# EAGLE design DWM_shield (EAGLE 7.5.0)
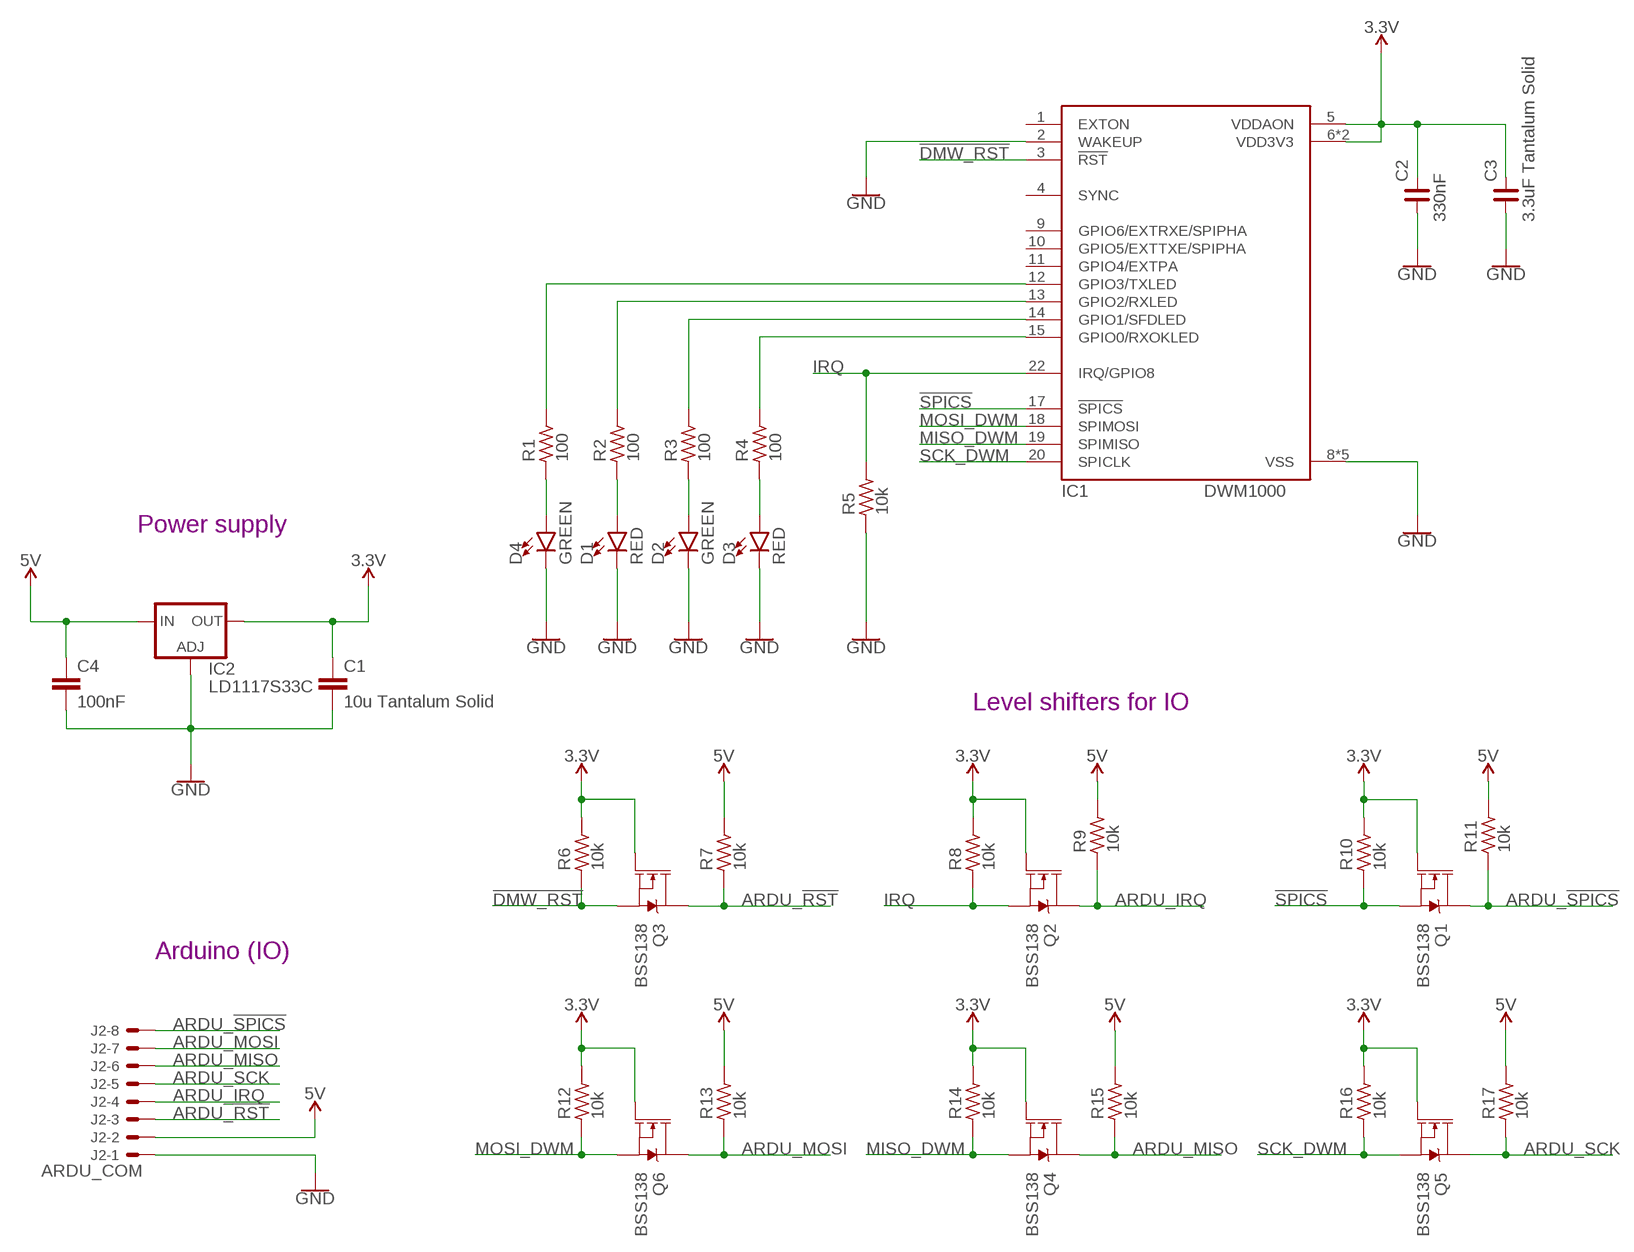
[diagram p0: schematic, sheet 1]

## Parts
C1  10u Tantalum Solid  C-EUC1206  [C1206]
C2  330nF  C_0805  [C0805]
C3  3.3uF Tantalum Solid  C_1206  [C1206]
C4  100nF  C-EUC0805  [C0805]
D1  RED  LED-RED1206  [LED-1206]
D2  GREEN  LED-GREEN1206  [LED-1206]
D3  RED  LED-RED1206  [LED-1206]
D4  GREEN  LED-GREEN1206  [LED-1206]
IC1  DWM1000  [DWM1000]
IC2  LD1117S33C  LD117ASTR  [SOT223]
J2  ARDU_COM  22-05-7088-08  [7395-08]
Q1  BSS138  MOSFET-NCH-AO3404A  [SOT23-3]
Q2  BSS138  MOSFET-NCH-AO3404A  [SOT23-3]
Q3  BSS138  MOSFET-NCH-AO3404A  [SOT23-3]
Q4  BSS138  MOSFET-NCH-AO3404A  [SOT23-3]
Q5  BSS138  MOSFET-NCH-AO3404A  [SOT23-3]
Q6  BSS138  MOSFET-NCH-AO3404A  [SOT23-3]
R1  100  R_0805  [R0805]
R2  100  R_0805  [R0805]
R3  100  R_0805  [R0805]
R4  100  R_0805  [R0805]
R5  10k  R_0805  [R0805]
R6  10k  R_0805  [R0805]
R7  10k  R_0805  [R0805]
R8  10k  R_0805  [R0805]
R9  10k  R_0805  [R0805]
R10  10k  R_0805  [R0805]
R11  10k  R_0805  [R0805]
R12  10k  R_0805  [R0805]
R13  10k  R_0805  [R0805]
R14  10k  R_0805  [R0805]
R15  10k  R_0805  [R0805]
R16  10k  R_0805  [R0805]
R17  10k  R_0805  [R0805]

## Nets
3.3V: C1.1 C2.2 C3.2 IC1.5(VDDAON) IC1.6(VDD3V3) IC1.7(VDD3V3) IC2.4(OUT) Q1.1(G) Q2.1(G) Q3.1(G) Q4.1(G) Q5.1(G) Q6.1(G) R6.2 R8.2 R10.2 R12.2 R14.2 R16.2
5V: C4.1 IC2.3(IN) J2.2 R7.2 R9.2 R11.2 R13.2 R15.2 R17.2
!DMW_RST: IC1.3(!RST) Q3.2(S) R6.1
!SPICS: IC1.17(!SPICS) Q1.2(S) R10.1
ARDU_!RST: J2.3 Q3.3(D) R7.1
ARDU_!SPICS: J2.8 Q1.3(D) R11.1
ARDU_IRQ: J2.4 Q2.3(D) R9.1
ARDU_MISO: J2.6 Q4.3(D) R15.1
ARDU_MOSI: J2.7 Q6.3(D) R13.1
ARDU_SCK: J2.5 Q5.3(D) R17.1
GND: C1.2 C2.1 C3.1 C4.2 D1.C D2.C D3.C D4.C IC1.2(WAKEUP) IC1.8(VSS) IC1.16(VSS) IC1.21(VSS) IC1.23(VSS) IC1.24(VSS) IC2.1(ADJ) J2.1 R5.1
IRQ: IC1.22(IRQ/GPIO8) Q2.2(S) R5.2 R8.1
MISO_DWM: IC1.19(SPIMISO) Q4.2(S) R14.1
MOSI_DWM: IC1.18(SPIMOSI) Q6.2(S) R12.1
N$1: IC1.15(GPIO0/RXOKLED) R4.2
N$2: IC1.14(GPIO1/SFDLED) R3.2
N$3: D4.A R1.1
N$4: IC1.13(GPIO2/RXLED) R2.2
N$5: IC1.12(GPIO3/TXLED) R1.2
N$6: D2.A R3.1
N$9: D1.A R2.1
N$12: D3.A R4.1
SCK_DWM: IC1.20(SPICLK) Q5.2(S) R16.1
Unconnected: IC1.1(EXTON) IC1.4(SYNC) IC1.9(GPIO6/EXTRXE/SPIPHA) IC1.10(GPIO5/EXTTXE/SPIPHA) IC1.11(GPIO4/EXTPA)

## Notes on the sheet
- Power supply
- Level shifters for IO
- Arduino (IO)

## Library data of the parts
C1 C4 = rcl:C-EU: CAPACITOR, European symbol; SPICEPREFIX: C
C2 C3 = rc-master-smd:C_: NON-POLARIZED CAP
D1 D3 = SparkFun-LED:LED-RED: Red SMD LED Used in manufacturing of most products at SparkFun Packages: 0603 - SMD 0603 package [Product Link] <http://docs.avagotech.com/docs/AV02-0551EN> 0603 SMART - SMD 0603 SMART package ( more efficient and expensive)[Product Link] <http://www.osram-os.com/Graphics/XPic2/00077099_0.pdf> 1206 - SMD1206 package [Product Link] <https://www.sparkfun.com/datasheets/DevTools/LilyPad/Q150OVS4.pdff> SparkFun Products: Pro Mini 328 -5V <https://www.sparkfun.com/products/821> RedBoard <https://www.sparkfun.com/products/12757> IOIO-OTG <https://www.sparkfun.com/products/13613>; PROD_ID: DIO-09912
D2 D4 = SparkFun-LED:LED-GREEN: Green SMD LED Used in manufacturing of various products at SparkFun Packages: 0603 - SMD 0603 package [Product Link] <http://www.futureelectronics.com/en/technologies/semiconductors/optoelectronics/leds/Pages/9894312-LTST-C190GKT.aspx?CrossPart=HSMG-C190&IM=0> LilyPad 1206 - SMD1206 LilyPad package [Product Link] <http://www.futureelectronics.com/en/Technologies/Product.aspx?ProductID=IN150NGHARVATEKCORPORATION2049943&IM=0> 1206 - SMD1206 package [Product Link] <http://www.futureelectronics.com/en/technologies/semiconductors/optoelectronics/leds/Pages/8315665-LTST-C150KGKT.aspx?IM=0> 1206 Bottom Mount -SMD 1206 Bottom Mount [Product Link] <http://www.digikey.com/product-detail/en/lite-on-inc/LTST-C230KGKT/160-1456-1-ND/386854> SparkFun Products: Pro Mini 328 -5V <https://www.sparkfun.com/products/821> RedBoard <https://www.sparkfun.com/products/12757> MP3 Trigger <https://www.sparkfun.com/products/13720> Makey Makey <https://www.sparkfun.com/products/11076>; PROD_ID: DIO-00862
IC1 = decawave:DWM1000
IC2 = v-reg:LD117A?*: Low drop fixed and adjustable positive voltage regulators 1 A Source: http://www.st.com/stonline/products/literature/ds/7194/ld1117axx.pdf
J2 = EP_molex_6410_7395:22-?-08: CONNECTOR wire to board 2.54 mm (.1 inch) pitch header
Q1-Q6 = SparkFun-DiscreteSemi:MOSFET-NCH: N-channel MOSFETs Voltage controlled devices that allow control of high current outputs. SparkFun Products: SparkFun OpenScale <https://www.sparkfun.com/products/13261> SparkFun Digital Sandbox <https://www.sparkfun.com/products/12651> SparkFun Monster Moto Shield <https://www.sparkfun.com/products/10182> SparkFun MOSFET Power Controller <https://www.sparkfun.com/products/11214>; PROD_ID: TRANS-12988; VALUE: 5.8A/30V/35mΩ
R1-R17 = rc-master-smd:R_: RESISTOR

## Board
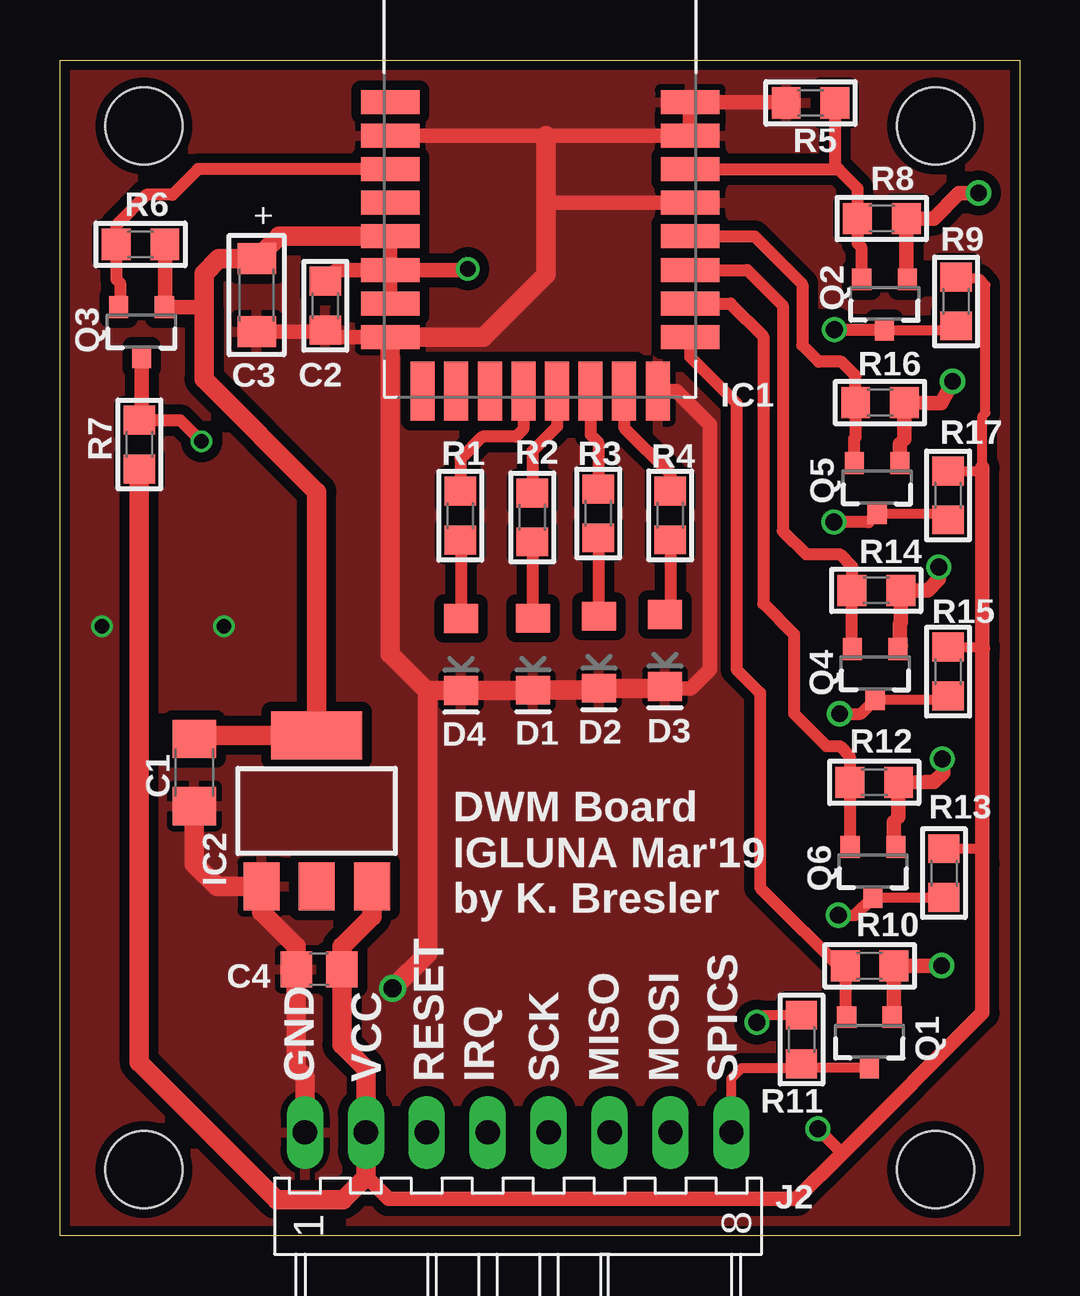
[diagram p1: board, top side]
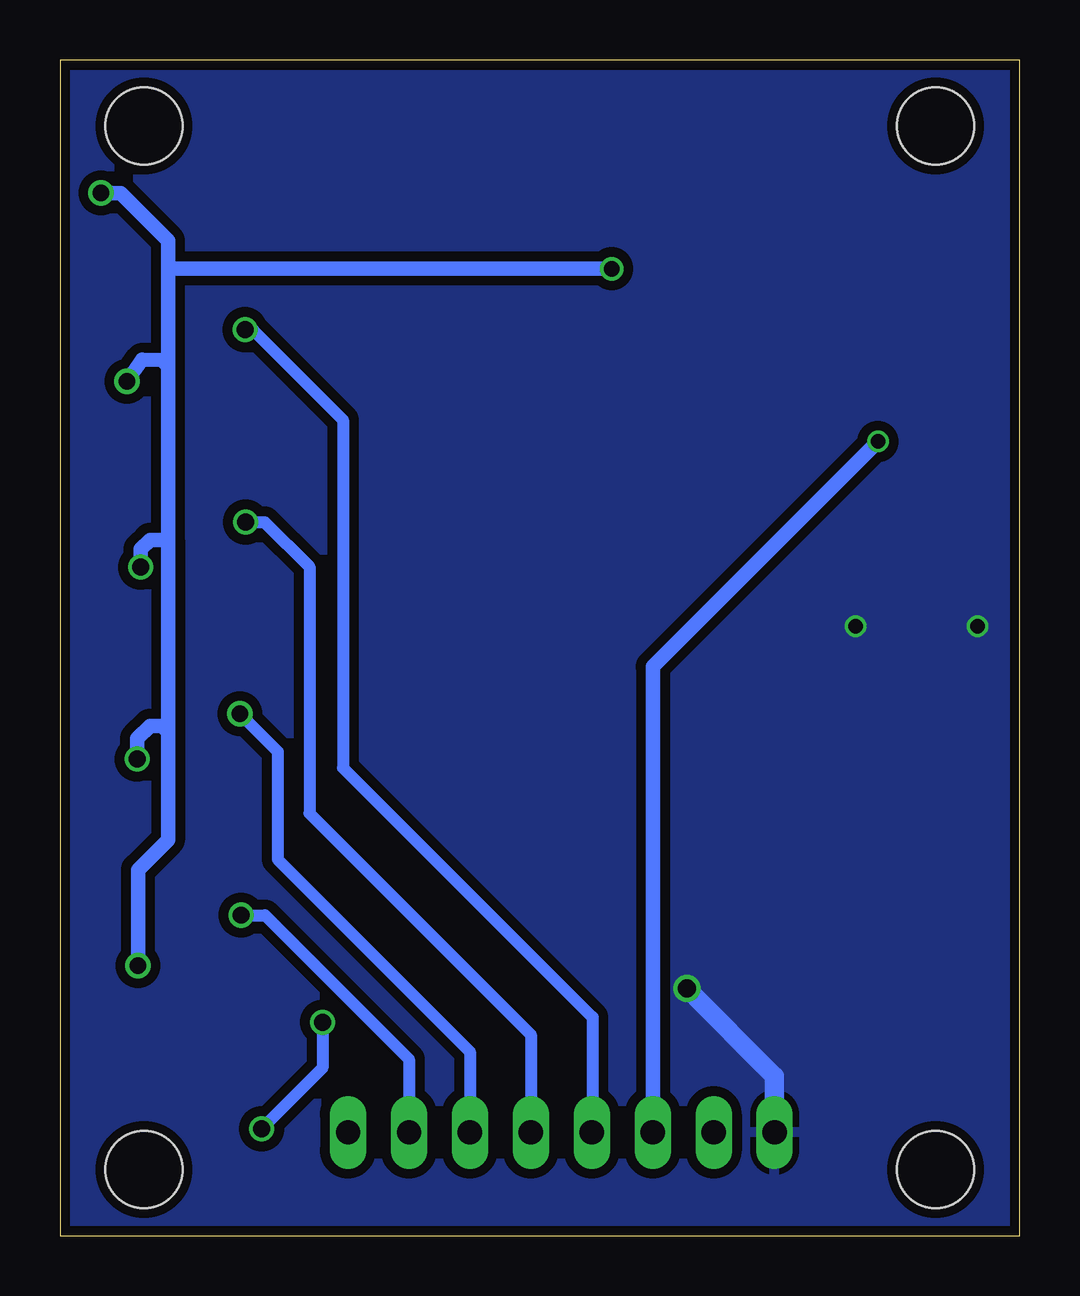
[diagram p2: board, bottom side, seen from below]

Size 40 x 49 mm. Coordinates in mm from the lower left corner, seen from the top.
Outline: 0,49 40,49 40,0 0,0 0,49
Copper layers (1*16): Top 0.035mm / dielectric 1.5mm / Bottom 0.035mm
Design rules "jlcpcb_rules": minimum track width 5mil, minimum drill 0.2mm, track to track 5mil, track to pad 5mil, pad to pad 5mil, via to via 5mil, smd to smd 5mil, copper to edge 0.2mm, drill to drill 12mil, minimum pad ring 3mil, minimum via ring 3mil, stop-mask expansion 4mil, vias tented up to drill 0mil, thermal gap 10mil
Holes 3.2 mm at 3.5,46.25 3.5,2.75 36.5,46.25 36.5,2.75

### Footprints (pad centres in the part's own frame; a part is rotated, then mirrored left to right if it is on the bottom)
C1206 = smd 1.6 x 1.8: 1 -1.4,0; 2 1.4,0
C0805 = smd 1.2 x 1.3: 1 -1.016,0; 2 1.016,0
C1206' = smd 1.3 x 1.6: 1 -1.524,0; 2 1.524,0
C0805' = smd 1.3 x 1.5: 1 -0.95,0; 2 0.95,0
LED-1206 = smd 1.2 x 1.4: A -1.5,0; C 1.5,0
DWM1000 = smd 2.45 x 1: 1 -6.25,0.8; 2 -6.25,-0.6; 3 -6.25,-2; 4 -6.25,-3.4; 5 -6.25,-4.8; 6 -6.25,-6.2; 7 -6.25,-7.6; 8 -6.25,-9; 17 6.25,-9; 18 6.25,-7.6; 19 6.25,-6.2; 20 6.25,-4.8; 21 6.25,-3.4; 22 6.25,-2; 23 6.25,-0.6; 24 6.25,0.8 | smd 1 x 2.45: 9 -4.9,-11.25; 10 -3.5,-11.25; 11 -2.1,-11.25; 12 -0.7,-11.25; 13 0.7,-11.25; 14 2.1,-11.25; 15 3.5,-11.25; 16 4.9,-11.25
SOT223 = smd 1.5 x 2: 1 -2.3,-3.15; 2 0,-3.15; 3 2.3,-3.15 | smd 3.8 x 2: 4 0,3.15
7395-08 = drill 1.016 long: 1 8.89,0; 2 6.35,0; 3 3.81,0; 4 1.27,0; 5 -1.27,0; 6 -3.81,0; 7 -6.35,0; 8 -8.89,0
SOT23-3 = smd 0.8 x 0.9: 1 -0.95,-1; 2 0.95,-1; 3 0,1.1
R0805 = smd 1.2 x 1.3: 1 -1.016,0; 2 1.016,0

### Placement (x,y rotation side)
C1  5.6,19.3 270 top
C2  11.06,38.76 90 top
C3  3.3uF Tantalum Solid  [C1206']  8.2,39.2 90 top
C4  100nF  [C0805']  10.8,11.1 180 top
D1  19.72,24.23 270 top
D2  22.47,24.31 270 top
D3  25.22,24.39 270 top
D4  16.72,24.22 270 top
IC1  20.02,46.45 0 top
IC2  10.7,17.7 0 top
J2  19.1,4.3 180 top
Q1  33.74,8.1 180 top
Q2  34.37,38.85 180 top
Q3  3.4,37.7 180 top
Q4  33.98,23.45 180 top
Q5  34.06,31.2 180 top
Q6  33.89,15.2 180 top
R1  16.69,30.01 90 top
R2  19.69,29.93 90 top
R3  22.44,30.1 90 top
R4  25.44,30.02 90 top
R5  31.29,47.21 0 top
R6  3.36,41.31 0 top
R7  3.31,32.97 270 top
R8  34.26,42.39 0 top
R9  37.36,38.93 90 top
R10  33.75,11.24 0 top
R11  30.91,8.17 90 top
R12  33.94,18.89 0 top
R13  36.85,15.11 90 top
R14  34.03,26.89 0 top
R15  37.02,23.51 90 top
R16  34.18,34.72 0 top
R17  37.02,30.85 90 top

### Tracks (layer width: path | path; a pad name or v marks a point on that pad's centre or on a via)
3.3V  (via drill 0.65, 0.7 pad 0.7)
  Top 0.61: IC1.5 IC1.6 | IC1.6 IC1.7 | Q4.1 35.05,24.57 35,24.61 35,25.5 35.05,25.55 R14.2 36.17,26.89 36.64,27.36 v36.64,27.86 | Q2.1 35.28,39.89 R8.2 36.42,42.39 37.47,43.44 38.27,43.44 v38.29,43.46 | Q5.1 35,33 35.2,33.2 R16.2 36.2,34.7 36.73,34.7 36.77,34.73 v37.21,35.6 | Q6.1 34.75,16.29 34.75,17.25 34.96,17.46 R12.2 36.1,18.9 36.43,18.9 36.82,19.28 v36.79,19.86 | Q1.1 34.69,9.19 34.77,9.37 R10.2 35.5,11.25 v36.75,11.25 | IC1.6 11.53,40.25 C2.2 | R6.2 4.38,38.73 Q3.1 6,38.7 | IC1.6 16.95,40.25 v17,40.3
  Top 0.813: IC1.5 9.13,41.65 C3.2 6.62,40.72 6,40.1 6,38.7 6,35.7 10.7,31 IC2.4 5.75,20.85 C1.1
  Bottom 0.61: v38.29,43.46 38.27,43.44 37.47,43.44 35.5,41.47 35.5,40.3 | v37.21,35.6 36.57,36.5 35.75,36.5 35.5,36.25 | v36.75,11.25 36.75,15.25 35.5,16.5 35.5,21 | v36.79,19.86 36.79,20.71 36.25,21.25 35.75,21.25 35.5,21 | 35.5,29 35.5,21 | v36.64,27.86 36.64,28.61 36.25,29 35.5,29 | 35.5,29 35.5,36.25 | 35.5,36.25 35.5,40.3 | v17,40.3 35.5,40.3
5V  (via drill 0.7)
  Top 0.406: 12.75,6.95 12.75,2.46 | 37.67,40.01 R9.2 | R11.2 29.35,9.19 v29.05,8.89 | R13.2 38.32,16.13 38.45,15.49 | R15.2 38.56,24.53 38.45,24.13 | R17.2 38.31,31.87 38.45,32 38.45,34.16 38.58,34.29 38.58,39.62 38.33,39.88 37.42,39.88
  Top 0.508: v31.59,4.45 32.61,3.43
  Top 0.61: 12.75,2.46 13.69,1.52 30.71,1.52 32.61,3.43 38.45,9.27 38.45,15.49 38.45,24.13 38.45,32 | 37.42,39.88 R9.2
  Top 0.813: IC2.3 13,13.3 11.75,12.05 C4.1 11.75,7.95 12.75,6.95 J2.2 12.75,2.46 12.75,2.45 11.8,1.5 9.02,1.5 3.31,7.21 R7.2
  Bottom 0.508: v29.05,8.89 29.05,6.99 v31.59,4.45
  Bottom 0.61: 12.75,3.35 J2.2
!DMW_RST
  Top 0.508: IC1.3 5.76,44.45 4.69,43.38 3.6,43.38 2.34,42.12 R6.1 2.34,39.86 2.5,39.7 2.5,38.75 Q3.2
!SPICS
  Top 0.508: Q1.2 32.73,9.14 R10.1 32.83,10.87 29.19,14.51 29.19,22.62 28.21,23.6 28.21,34.69 26.27,36.63 IC1.17
ARDU_!RST  (via drill 0.6)
  Top 0.508: R7.1 5.01,33.99 v5.9,33.1
  Top 0.61: Q3.3 3.4,34.08 R7.1
  Bottom 0.61: v5.9,33.1 15.29,23.71 J2.3
ARDU_!SPICS
  Top 0.406: Q1.3 31.06,7 R11.1 30.74,6.99 28.42,6.99 27.99,6.55 J2.8
ARDU_IRQ  (via drill 0.7 pad 0.7)
  Top 0.305: 34.36,37.76 Q2.3
  Top 0.406: Q2.3 37.19,37.75 R9.1
  Top 0.508: v32.29,37.76 34.36,37.76
  Bottom 0.508: v32.29,37.76 31.96,37.76 28.2,34 28.2,19.5 17.8,9.1 17.8,4.33 J2.4
ARDU_MISO  (via drill 0.7 pad 0.7)
  Top 0.406: Q4.3 36.88,22.35 R15.1
  Top 0.508: v32.5,21.75 33.38,21.75 Q4.3
  Top 0.61: 37.02,22.28 R15.1
  Bottom 0.508: v32.5,21.75 30.93,20.18 30.93,15.68 22.91,7.67 J2.6
ARDU_MOSI  (via drill 0.7 pad 0.7)
  Top 0.406: Q6.3 R13.1
  Top 0.508: v32.45,13.35 33.15,13.36 Q6.3
  Bottom 0.508: v32.45,13.35 31.45,13.35 25.45,7.35 J2.7
ARDU_SCK  (via drill 0.7 pad 0.7)
  Top 0.406: Q5.3 36.76,30.1 R17.1
  Top 0.508: Q5.3 33.7,29.74 v32.26,29.74
  Bottom 0.508: v32.26,29.74 31.46,29.74 29.6,27.88 29.6,17.6 20.37,8.37 J2.5
GND  (via drill 0.6, 0.75)
  Top 0.61: IC1.2 20.25,45.85 IC1.23 IC1.24 30.23,47.25 R5.1 | 22.55,22.89 D2.C | 19.8,22.81 D1.C | IC1.8 11.35,37.45 C2.1 10.99,37.68 C3.1 | 25.14,22.81 26.31,22.81 27.1,23.6 27.1,33.8 25.7,35.2 IC1.16 | IC1.21 20.3,43.05 20.25,43
  Top 0.813: 19.8,22.81 D1.C D4.C 15.32,22.72 | D1.C 22.39,22.73 22.55,22.89 | D2.C 25.14,22.81 D3.C | 15.32,22.72 15.3,22.7 13.77,24.23 IC1.8 17.65,37.45 20.25,40.05 20.25,43 20.25,45.85 | J2.1 10.21,6.59 9.85,6.95 C4.2 9.85,12.05 8.4,13.5 IC2.1 6.55,14.55 5.6,15.5 C1.2 | 15.32,22.72 15.32,11.75 v13.87,10.3
  Bottom 0.813: v13.87,10.3 10.21,6.64 J2.1
  other vias: 1.75,25.4 6.83,25.4
  pour Top (isolate 0.406): 0,49 40,49 40,0 0,0
  pour Bottom (isolate 0.406): 0,49 40,49 40,0 0,0
IRQ
  Top 0.508: IC1.22 32.45,44.45 | Q2.2 33.4,39.87 33.4,41.2 33.24,41.36 R8.1 33.24,43.66 32.45,44.45 | R5.2 32.31,44.59 32.45,44.45
MISO_DWM
  Top 0.305: Q4.2 33.01,24.47
  Top 0.508: 33.01,24.47 R14.1 33.01,27.89 32.5,28.4 31.11,28.4 30.13,29.37 30.13,38.77 28.65,40.25 IC1.19
MOSI_DWM
  Top 0.508: Q6.2 32.92,16.22 R12.1 32.92,19.98 32.5,20.4 31.95,20.4 30.6,21.75 30.6,25.06 29.32,26.34 29.32,37.48 27.95,38.85 IC1.18
N$1
  Top 0.508: IC1.15 23.52,33.68 25.44,31.76 R4.2
N$2
  Top 0.508: IC1.14 22.12,33.38 22.44,33.06 R3.2
N$3
  Top 0.508: R1.1 16.72,28.96 D4.A
N$4
  Top 0.508: IC1.13 20.72,33.72 19.69,32.69 R2.2
N$5
  Top 0.508: IC1.12 19.32,33.62 19,33.3 17.6,33.3 16.69,32.39 R1.2
N$6
  Top 0.305: 22.44,25.84 D2.A
  Top 0.508: R3.1 22.44,25.84
N$9
  Top 0.305: 19.69,25.76 D1.A
  Top 0.508: R2.1 19.69,25.76
N$12
  Top 0.305: D3.A 25.27,25.93
  Top 0.508: R4.1 25.44,26.11 25.27,25.93
SCK_DWM
  Top 0.508: Q5.2 33.1,33.2 33.16,33.26 R16.1 33.16,35.84 32.58,36.42 31.63,36.42 30.95,37.11 30.95,39.65 28.95,41.65 IC1.20

### Text on the board
tNames: + | DWM Board / IGLUNA Mar'19 / by K. Bresler | GND | VCC | RESET | IRQ | SCK | MISO | MOSI | SPICS